# Altium schematic sheet BBB Headers.SchDoc: BBB Headers
size Tabloid; DocumentNumber: LM-003; Revision: C; SheetNumber: 1; SheetTotal: 4
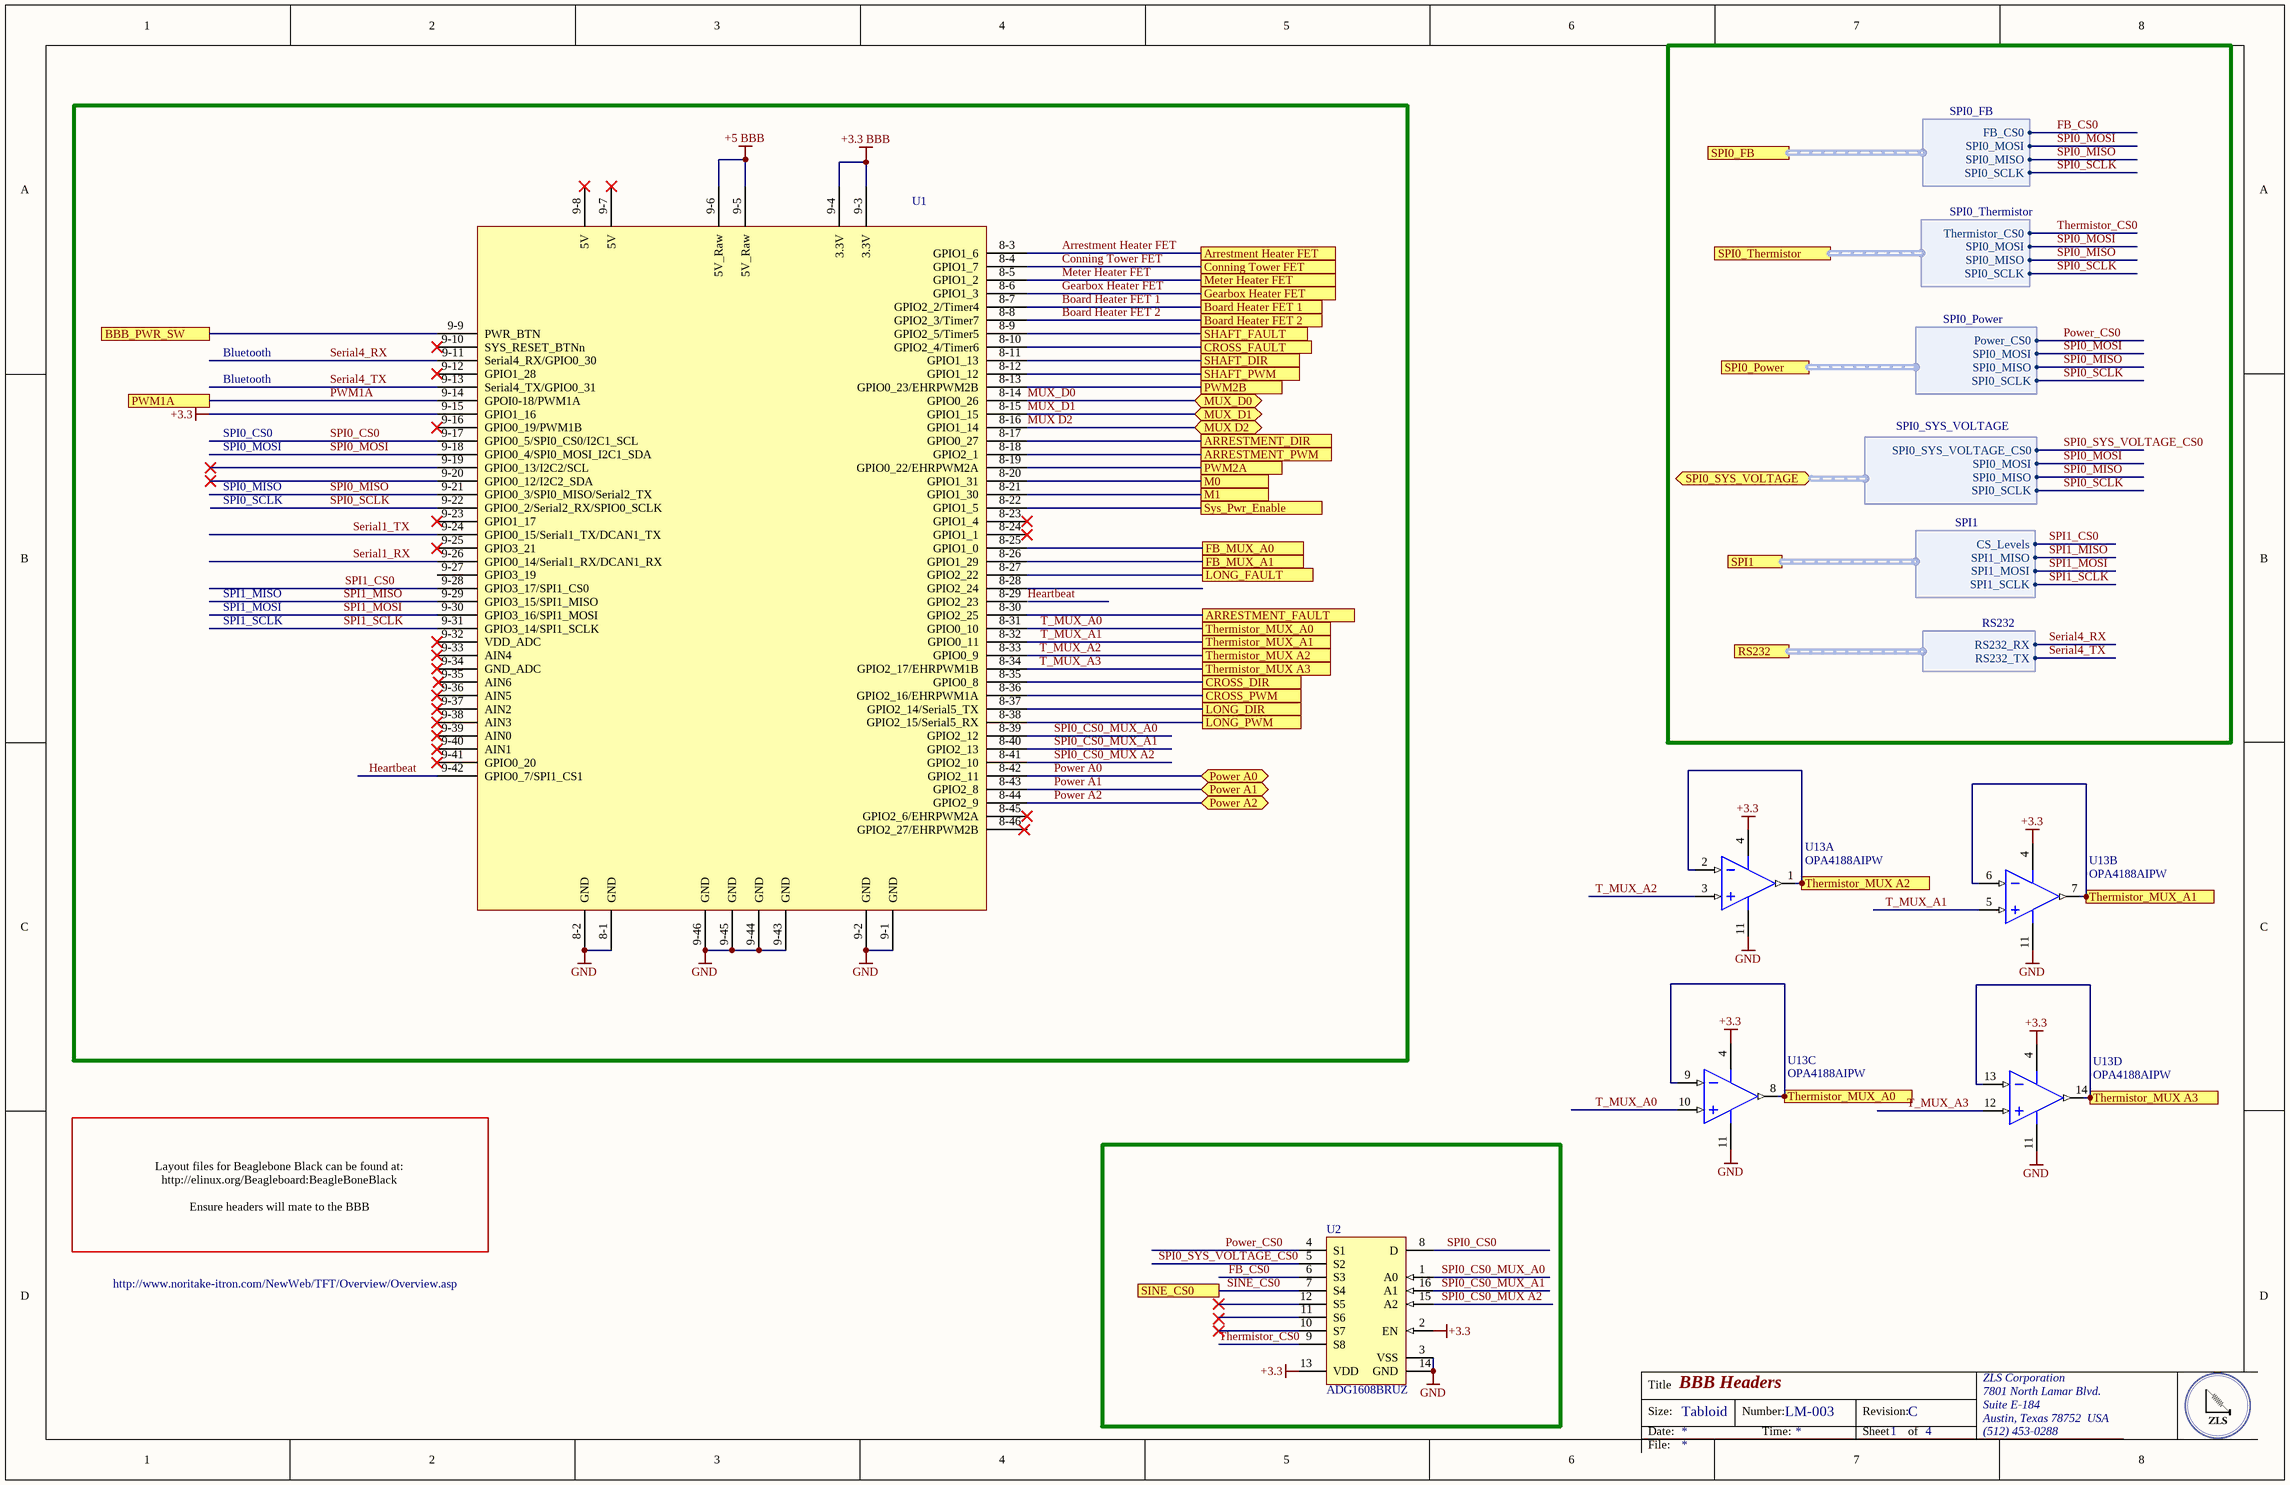
[diagram p0: BBB Headers.SchDoc]

## Parts
U1  BBB Header x 2  [Beaglebone Black Thru]  (value not drawn)
U2  ADG1608BRUZ  [ADI-RU-16_M]
U13  OPA4188AIPW  [PW0014A_N]  (parts A,B,C,D of 4)

## Ports
Arrestment Heater FET, ARRESTMENT_DIR, ARRESTMENT_FAULT, ARRESTMENT_PWM, BBB_PWR_SW, Board Heater FET 1, Board Heater FET 2, Conning Tower FET, CROSS_DIR, CROSS_FAULT, CROSS_PWM, FB_MUX_A0, FB_MUX_A1, Gearbox Heater FET, LONG_DIR, LONG_FAULT, LONG_PWM, M0, M1, Meter Heater FET, MUX D2, MUX_D0, MUX_D1, Power A0, Power A1, Power A2, PWM1A, PWM2A, PWM2B, RS232 (harness RS232), SHAFT_DIR, SHAFT_FAULT, SHAFT_PWM, SINE_CS0, SPI0_FB (harness SPI0_FB), SPI0_Power (harness SPI0_Power), SPI0_SYS_VOLTAGE (harness SPI0_SYS_VOLTAGE), SPI0_Thermistor (harness SPI0_Thermistor), SPI1 (harness SPI1), Sys_Pwr_Enable, Thermistor_MUX A2, Thermistor_MUX A3, Thermistor_MUX_A0, Thermistor_MUX_A1

## Harnesses
RS232: RS232_RX, RS232_TX
SPI1: CS_Levels, SPI1_MISO, SPI1_MOSI, SPI1_SCLK
SPI0_Power: Power_CS0, SPI0_MOSI, SPI0_MISO, SPI0_SCLK
SPI0_Thermistor: Thermistor_CS0, SPI0_MOSI, SPI0_MISO, SPI0_SCLK
SPI0_FB: FB_CS0, SPI0_MOSI, SPI0_MISO, SPI0_SCLK
SPI0_SYS_VOLTAGE: SPI0_SYS_VOLTAGE_CS0, SPI0_MOSI, SPI0_MISO, SPI0_SCLK

## Nets
+3.3: U1.9-15(GPIO1_16) U2.2(EN) U2.13(VDD) U13.4(V+)
+3.3 BBB: U1.9-3(3.3V) U1.9-4(3.3V)
+5 BBB: U1.9-5(5V_Raw) U1.9-6(5V_Raw)
GND: U1.8-1(GND) U1.8-2(GND) U1.9-1(GND) U1.9-2(GND) U1.9-43(GND) U1.9-44(GND) U1.9-45(GND) U1.9-46(GND) U2.3(VSS) U2.14(GND) U13.11(V-)
Arrestment Heater FET: U1.8-3(GPIO1_6) ; port Arrestment Heater FET
ARRESTMENT_DIR: U1.8-17(GPIO0_27) ; port ARRESTMENT_DIR
ARRESTMENT_FAULT: U1.8-30(GPIO2_25) ; port ARRESTMENT_FAULT
ARRESTMENT_PWM: U1.8-18(GPIO2_1) ; port ARRESTMENT_PWM
BBB_PWR_SW: U1.9-9(PWR_BTN) ; port BBB_PWR_SW
Board Heater FET 1: U1.8-7(GPIO2_2/Timer4) ; port Board Heater FET 1
Board Heater FET 2: U1.8-8(GPIO2_3/Timer7) ; port Board Heater FET 2
Conning Tower FET: U1.8-4(GPIO1_7) ; port Conning Tower FET
CROSS_DIR: U1.8-35(GPIO0_8) ; port CROSS_DIR
CROSS_FAULT: U1.8-10(GPIO2_4/Timer6) ; port CROSS_FAULT
CROSS_PWM: U1.8-36(GPIO2_16/EHRPWM1A) ; port CROSS_PWM
FB_CS0: U2.6(S3) ; port SPI0_FB.FB_CS0
FB_MUX_A0: U1.8-25(GPIO1_0) ; port FB_MUX_A0
FB_MUX_A1: U1.8-26(GPIO1_29) ; port FB_MUX_A1
Gearbox Heater FET: U1.8-6(GPIO1_3) ; port Gearbox Heater FET
Heartbeat: U1.8-29(GPIO2_23) U1.9-42(GPIO0_7/SPI1_CS1)
LONG_DIR: U1.8-37(GPIO2_14/Serial5_TX) ; port LONG_DIR
LONG_FAULT: U1.8-27(GPIO2_22) ; port LONG_FAULT
LONG_PWM: U1.8-38(GPIO2_15/Serial5_RX) ; port LONG_PWM
M0: U1.8-20(GPIO1_31) ; port M0
M1: U1.8-21(GPIO1_30) ; port M1
Meter Heater FET: U1.8-5(GPIO1_2) ; port Meter Heater FET
MUX D2: U1.8-16(GPIO1_14) ; port MUX D2
MUX_D0: U1.8-14(GPIO0_26) ; port MUX_D0
MUX_D1: U1.8-15(GPIO1_15) ; port MUX_D1
Power A0: U1.8-42(GPIO2_11) ; port Power A0
Power A1: U1.8-43(GPIO2_8) ; port Power A1
Power A2: U1.8-44(GPIO2_9) ; port Power A2
Power_CS0: U2.4(S1) ; port SPI0_Power.Power_CS0
PWM1A: U1.9-14(GPOI0-18/PWM1A) ; port PWM1A
PWM2A: U1.8-19(GPIO0_22/EHRPWM2A) ; port PWM2A
PWM2B: U1.8-13(GPIO0_23/EHRPWM2B) ; port PWM2B
Serial1_RX: U1.9-26(GPIO0_14/Serial1_RX/DCAN1_RX)
Serial1_TX: U1.9-24(GPIO0_15/Serial1_TX/DCAN1_TX)
Serial4_RX: U1.9-11(Serial4_RX/GPIO0_30) ; port RS232.RS232_RX
Serial4_TX: U1.9-13(Serial4_TX/GPIO0_31) ; port RS232.RS232_TX
SHAFT_DIR: U1.8-11(GPIO1_13) ; port SHAFT_DIR
SHAFT_FAULT: U1.8-9(GPIO2_5/Timer5) ; port SHAFT_FAULT
SHAFT_PWM: U1.8-12(GPIO1_12) ; port SHAFT_PWM
SINE_CS0: U2.7(S4) ; port SINE_CS0
SPI0_CS0: U1.9-17(GPIO0_5/SPI0_CS0/I2C1_SCL) U2.8(D)
SPI0_CS0_MUX A2: U1.8-41(GPIO2_10) U2.15(A2)
SPI0_CS0_MUX_A0: U1.8-39(GPIO2_12) U2.1(A0)
SPI0_CS0_MUX_A1: U1.8-40(GPIO2_13) U2.16(A1)
SPI0_MISO: U1.9-21(GPIO0_3/SPI0_MISO/Serial2_TX) ; port SPI0_Power.SPI0_MISO, port SPI0_Thermistor.SPI0_MISO, port SPI0_FB.SPI0_MISO, port SPI0_SYS_VOLTAGE.SPI0_MISO
SPI0_MOSI: U1.9-18(GPIO0_4/SPI0_MOSI_I2C1_SDA) ; port SPI0_Power.SPI0_MOSI, port SPI0_Thermistor.SPI0_MOSI, port SPI0_FB.SPI0_MOSI, port SPI0_SYS_VOLTAGE.SPI0_MOSI
SPI0_SCLK: U1.9-22(GPIO0_2/Serial2_RX/SPIO0_SCLK) ; port SPI0_Power.SPI0_SCLK, port SPI0_Thermistor.SPI0_SCLK, port SPI0_FB.SPI0_SCLK, port SPI0_SYS_VOLTAGE.SPI0_SCLK
SPI0_SYS_VOLTAGE_CS0: U2.5(S2) ; port SPI0_SYS_VOLTAGE.SPI0_SYS_VOLTAGE_CS0
SPI1_CS0: U1.9-28(GPIO3_17/SPI1_CS0) ; port SPI1.CS_Levels
SPI1_MISO: U1.9-29(GPIO3_15/SPI1_MISO) ; port SPI1.SPI1_MISO
SPI1_MOSI: U1.9-30(GPIO3_16/SPI1_MOSI) ; port SPI1.SPI1_MOSI
SPI1_SCLK: U1.9-31(GPIO3_14/SPI1_SCLK) ; port SPI1.SPI1_SCLK
Sys_Pwr_Enable: U1.8-22(GPIO1_5) ; port Sys_Pwr_Enable
T_MUX_A0: U1.8-31(GPIO0_10) U13.8(OUT_C) U13.9(IN_C-) U13.10(IN_C+) ; port Thermistor_MUX_A0
T_MUX_A1: U1.8-32(GPIO0_11) U13.5(IN_B+) U13.6(IN_B-) U13.7(OUT_B) ; port Thermistor_MUX_A1
T_MUX_A2: U1.8-33(GPIO0_9) U13.1(OUT_A) U13.2(IN_A-) U13.3(IN_A+) ; port Thermistor_MUX A2
T_MUX_A3: U1.8-34(GPIO2_17/EHRPWM1B) U13.12(IN_D+) U13.13(IN_D-) U13.14(OUT_D) ; port Thermistor_MUX A3
Thermistor_CS0: U2.9(S8) ; port SPI0_Thermistor.Thermistor_CS0

Not connected (* = marked no-connect by the designer): U1 8-23(GPIO1_4)* 8-24(GPIO1_1)* 8-28(GPIO2_24) 8-45(GPIO2_6/EHRPWM2A)* 8-46(GPIO2_27/EHRPWM2B) 9-7(5V)* 9-8(5V)* 9-10(SYS_RESET_BTNn)* 9-12(GPIO1_28)* 9-16(GPIO0_19/PWM1B)* 9-19(GPIO0_13/I2C2/SCL)* 9-20(GPIO0_12/I2C2_SDA)* 9-23(GPIO1_17)* 9-25(GPIO3_21)* 9-27(GPIO3_19) 9-32(VDD_ADC)* 9-33(AIN4)* 9-34(GND_ADC)* 9-35(AIN6) 9-36(AIN5)* 9-37(AIN2)* 9-38(AIN3)* 9-39(AIN0)* 9-40(AIN1)* 9-41(GPIO0_20)*; U2 10(S7)* 11(S6) 12(S5)*

## Notes on the sheet
- Bluetooth
- SPI0_CS0
- SPI0_MISO
- SPI0_MOSI
- SPI0_SCLK
- SPI1_MISO
- SPI1_SCLK
- SPI1_MOSI
- Layout files for Beaglebone Black can be found at:
  http://elinux.org/Beagleboard:BeagleBoneBlack
  Ensure headers will mate to the BBB
- http://www.noritake-itron.com/NewWeb/TFT/Overview/Overview.asp
- Title
- Size:
- Date:
- Tabloid
- Number:
- Time:
- Revision:
- Sheet
- of
- ZLS Corporation
- 7801 North Lamar Blvd.
- Suite E-184
- Austin, Texas 78752  USA
- (512) 453-0288
- File:

## Library data of the parts
U1 = Beaglebone_Black: Beaglebone Black Header; Manufacturer: Samtec Inc.; Manufacturer Part Number: SSW-123-03-G-D; Connector Type: Receptacle; Style: Board to Board or Cable; Number of Positions: 46; Number of Positions Loaded: All; Pitch - Mating: 0.100" (2.54mm); Contact Length - Post: 0.394" (10.00mm); Material Flammability Rating: UL94 V-0; Current Rating: 5.7A per Contact; Supplier 1: Digi-Key; Supplier Part Number 1: SSW-123-03-G-D-ND; RoHS: RoHS Compliant; Category: Connectors, Interconnects; Stock 1: 0; Pricing 1: 1=6.51 (USD); Packaging: Bulk; Part Status: Active; Contact Type: Forked; Row Spacing - Mating: 0.100" (2.54mm); Mounting Type: Through Hole; Termination: Solder; Fastening Type: Push-Pull; Contact Finish - Mating: Gold; Contact Finish Thickness - Mating: 20.0µin (0.51µm); Insulation Color: Black; Insulation Height: 0.335" (8.51mm); Operating Temperature: -55°C ~ 125°C; Contact Finish - Post: Gold; Mated Stacking Heights: -; Ingress Protection: -; Features: -; Voltage Rating: -; Applications: -; Insulation Material: Liquid Crystal Polymer (LCP); Contact Shape: Square; Contact Material: Phosphor Bronze; Contact Finish Thickness - Post: 3.00µin (0.076µm)
U2 = CMP-0793-00136-1: 4.5 Ohm Ron, 8-Channel +/-5 V,+12 V, +5 V and +3.3 V Multiplexer, 16-pin SOP (RU-16), Tube; Manufacturer: Analog Devices Inc.; Multiplexer/Demultiplexer Circuit: 8:1; On-State Resistance (Max): 4.5 Ohm; Channel-to-Channel Matching (&Delta;Ron): 120 mOhm; Voltage - Supply, Single (V+): 3.3 V ~ 16 V; Voltage - Supply, Dual (V±): ±3.3 V ~ 8 V; Switch Time (Ton, Toff) (Max): 94ns, 93ns; -3db Bandwidth: 40MHz; Charge Injection: 29pC; Channel Capacitance (CS(off), CD(off)): 19pF, 117pF; Current - Leakage (IS(off)) (Max): 100pA; Crosstalk: -64dB @ 1MHz; Supplier 1: Digi-Key; Supplier Part Number 1: ADG1608BRUZ-ND; Manufacturer Part Number: ADG1608BRUZ; RoHS: RoHS Compliant; Category: Integrated Circuits (ICs); Stock 1: 1151; Pricing 1: 1=9.31, 96=8.01552, 192=6.95979, 576=6.0605 (USD); Packaging: Tube; Part Status: Active; Switch Circuit: -; Operating Temperature: -40°C ~ 125°C (TA); Package / Case: 16-TSSOP (0.173", 4.40mm Width); Supplier Device Package: 16-TSSOP; Base Part Number: ADG1608; ComponentLink1URL: http://www.analog.com/media/en/technical-documentation/data-sheets/ADG1608_1609.pdf; ComponentLink1Description: http://www.analog.com/media/en/technical-documentation/data-sheets/ADG1608_1609.pdf
U13 = CMP-0809-00010-2: 0.03 uV/C, Low Noise, Rail-to-Rail Output, Zero-Drift Operational Amplifier, 4 to 36 V, -40 to 125 degC, 14-pin SOP (PW14), Green (RoHS & no Sb/Br); Manufacturer: Texas Instruments; Number of Channels: 4; SubFamily: High Supply Voltage Amplifier (>=30V), Low Noise Amp (<=10nV/rtHz), Low Offset Voltage Amplifier (<=500uV), Low Power Amp (<=500uA), Zero Drift Precision Amplifier; CMRR(Min)(dB): 120; Iq per channel(Max)(mA): 0.475; Offset Drift(Typ)(uV/C): 0.03; Rating: Catalog; GBW(Typ)(MHz): 2; Total Supply Voltage(Max)(+5V is 5, +/-5V is 10): 36; Slew Rate(Typ)(V/us): 0.8; PackageReference: PW0014A; Eco-Plan: Green (RoHS & no Sb/Br); PackageVersion: 4040064-3/G, 02/2011; PartNumber: OPA4188AIPW; Code_JEDEC: MO-153; ComponentLink3URL: http://www.ti.com/litv/pdf/mpds360; ComponentLink1Description: Manufacturer URL; ComponentLink2Description: Datasheet; PackageDescription: 14-Pin Plastic Small Outline, Body 5 x 4.4 mm, Pitch 0.65 mm; Total Supply Voltage(Min)(+5V is 5, +/-5V is 10): 4; ComponentLink1URL: http://www.ti.com/; ComponentLink3Description: Package Specification; DatasheetVersion: SBOS641B; Mounting Technology: Surface Mount; ComponentLink2URL: http://www.ti.com/lit/ds/symlink/opa4188.pdf; PartId: 1